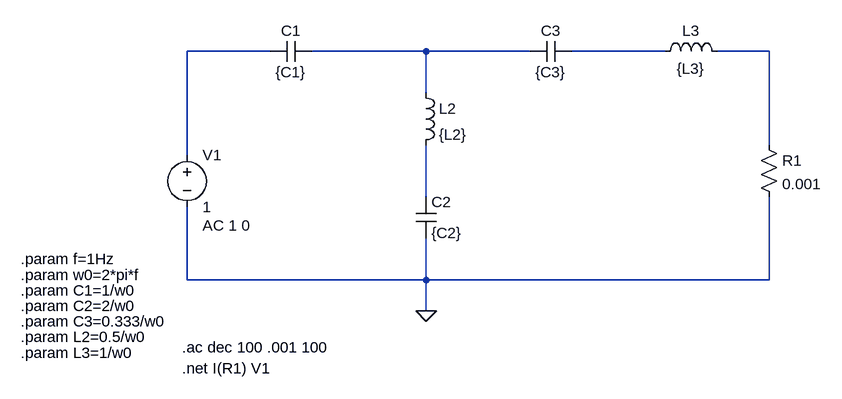
[diagram p0: schematic EJ1.asc]
EJ1.asc, the LTspice schematic file:
Version 4
SHEET 1 1016 680
WIRE 160 32 32 32
WIRE 400 32 224 32
WIRE 560 32 400 32
WIRE 768 32 624 32
WIRE 928 32 848 32
WIRE 400 96 400 32
WIRE 928 176 928 32
WIRE 32 192 32 32
WIRE 400 256 400 176
WIRE 32 384 32 272
WIRE 400 384 400 320
WIRE 400 384 32 384
WIRE 928 384 928 256
WIRE 928 384 400 384
WIRE 400 432 400 384
FLAG 400 432 0
SYMBOL voltage 32 176 R0
WINDOW 123 24 124 Left 2
WINDOW 39 0 0 Left 0
SYMATTR InstName V1
SYMATTR Value 1
SYMATTR Value2 AC 1 0
SYMBOL cap 224 16 R90
WINDOW 0 0 32 VBottom 2
WINDOW 3 32 32 VTop 2
SYMATTR InstName C1
SYMATTR Value {C1}
SYMBOL cap 624 16 R90
WINDOW 0 0 32 VBottom 2
WINDOW 3 32 32 VTop 2
SYMATTR InstName C3
SYMATTR Value {C3}
SYMBOL ind 752 48 R270
WINDOW 0 32 56 VTop 2
WINDOW 3 5 56 VBottom 2
SYMATTR InstName L3
SYMATTR Value {L3}
SYMBOL ind 384 80 R0
SYMATTR InstName L2
SYMATTR Value {L2}
SYMBOL cap 384 256 R0
SYMATTR InstName C2
SYMATTR Value {C2}
SYMBOL res 912 160 R0
SYMATTR InstName R1
SYMATTR Value 0.001
TEXT 24 520 Left 2 !.net I(R1) V1
TEXT 24 488 Left 2 !.ac dec 100 .001 100
TEXT -224 352 Left 2 !.param f=1Hz
TEXT -224 376 Left 2 !.param w0=2*pi*f
TEXT -224 400 Left 2 !.param C1=1/w0
TEXT -224 424 Left 2 !.param C2=2/w0
TEXT -224 448 Left 2 !.param C3=0.333/w0
TEXT -224 472 Left 2 !.param L2=0.5/w0
TEXT -224 496 Left 2 !.param L3=1/w0

The netlist it stands for:
* EJ1.asc
V1 N001 0 1 AC 1 0
C1 N002 N001 {C1}
C3 N003 N002 {C3}
L3 N003 N004 {L3}
L2 N002 N005 {L2}
C2 N005 0 {C2}
R1 N004 0 0.001
.net I(R1) V1
.ac dec 100 .001 100
.param f=1Hz
.param w0=2*pi*f
.param C1=1/w0
.param C2=2/w0
.param C3=0.333/w0
.param L2=0.5/w0
.param L3=1/w0
.backanno
.end